# Altium schematic sheet Connector.SchDoc
size A
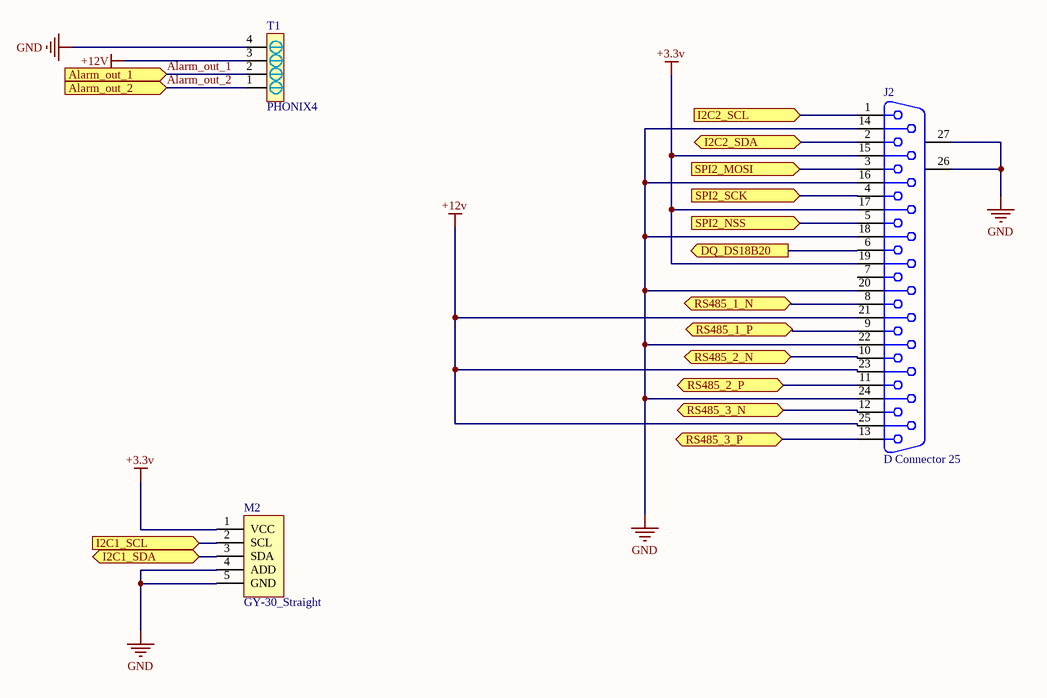
[diagram p0: Connector.SchDoc]

## Parts
J2  D Connector 25  [DSUB1.385-2H25A]
M2  GY-30_Straight  [GY-30_Straight]
T1  PHONIX4  [PHONIX4]

## Ports
Alarm_out_1 (in), Alarm_out_2 (in), DQ_DS18B20 (out), I2C1_SCL (in), I2C1_SDA (bidir), I2C2_SCL (in), I2C2_SDA (bidir), RS485_1_N (bidir), RS485_1_P (bidir), RS485_2_N (bidir), RS485_2_P (bidir), RS485_3_N (bidir), RS485_3_P (bidir), SPI2_MOSI (in), SPI2_NSS (in), SPI2_SCK (in)

## Nets
+3.3v: J2.15 J2.17 J2.19 M2.1(VCC)
+12v: J2.21 J2.23 J2.25 T1.3
GND: J2.14 J2.16 J2.18 J2.20 J2.22 J2.24 J2.26(MH1) J2.27(MH2) M2.4(ADD) M2.5(GND) T1.4
Alarm_out_1: T1.2 ; port Alarm_out_1
Alarm_out_2: T1.1 ; port Alarm_out_2
DQ_DS18B20: J2.6 ; port DQ_DS18B20
I2C1_SCL: M2.2(SCL) ; port I2C1_SCL
I2C1_SDA: M2.3(SDA) ; port I2C1_SDA
I2C2_SCL: J2.1 ; port I2C2_SCL
I2C2_SDA: J2.2 ; port I2C2_SDA
RS485_1_N: J2.8 ; port RS485_1_N
RS485_1_P: J2.9 ; port RS485_1_P
RS485_2_N: J2.10 ; port RS485_2_N
RS485_2_P: J2.11 ; port RS485_2_P
RS485_3_N: J2.12 ; port RS485_3_N
RS485_3_P: J2.13 ; port RS485_3_P
SPI2_MOSI: J2.3 ; port SPI2_MOSI
SPI2_NSS: J2.5 ; port SPI2_NSS
SPI2_SCK: J2.4 ; port SPI2_SCK

Not connected (* = marked no-connect by the designer): J2 7

## Library data of the parts
J2 = D Connector 25: Receptacle Assembly, 25 Position, Right Angle; PackageDocument: U; Positions: 25; Published: 15-Jun-2001; LatestRevisionDate: 17-Jul-2002; LatestRevisionNote: Re-released for DXP Platform.; DatasheetDocument: 19-Mar-1999; PackageReference: 787202; Publisher: Altium Limited; Orientation: Right Angle; Gender: Receptacle
M2 = GY-30_Straight: LatestRevisionDate: 17-Jul-2002; LatestRevisionNote: Re-released for DXP Platform.; Publisher: Altium Limited